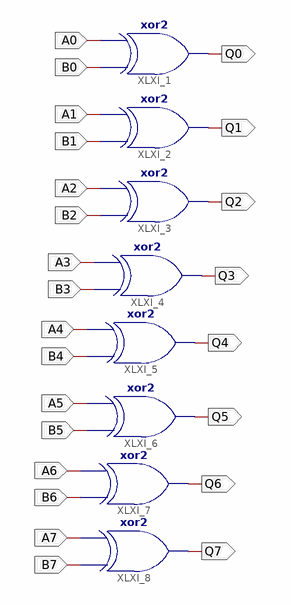
[diagram p0: schematic sheet 1]
// Xilinx ISE schematic SXOR.sch (spartan6) as structural Verilog: 8 symbols, 24 ports
module SXOR (
  input  A0,
  input  B0,
  input  A1,
  input  B1,
  input  A2,
  input  B2,
  input  A3,
  input  B3,
  input  A4,
  input  B4,
  input  A5,
  input  B5,
  input  A6,
  input  B6,
  input  A7,
  input  B7,
  output Q0,
  output Q1,
  output Q2,
  output Q3,
  output Q4,
  output Q5,
  output Q6,
  output Q7
);

  xor XLXI_1 (Q0, B0, A0);
  xor XLXI_2 (Q1, B1, A1);
  xor XLXI_3 (Q2, B2, A2);
  xor XLXI_4 (Q3, B3, A3);
  xor XLXI_5 (Q4, B4, A4);
  xor XLXI_6 (Q5, B5, A5);
  xor XLXI_7 (Q6, B6, A6);
  xor XLXI_8 (Q7, B7, A7);
endmodule
